# Altium project AD Sensor Module.PrjPcb
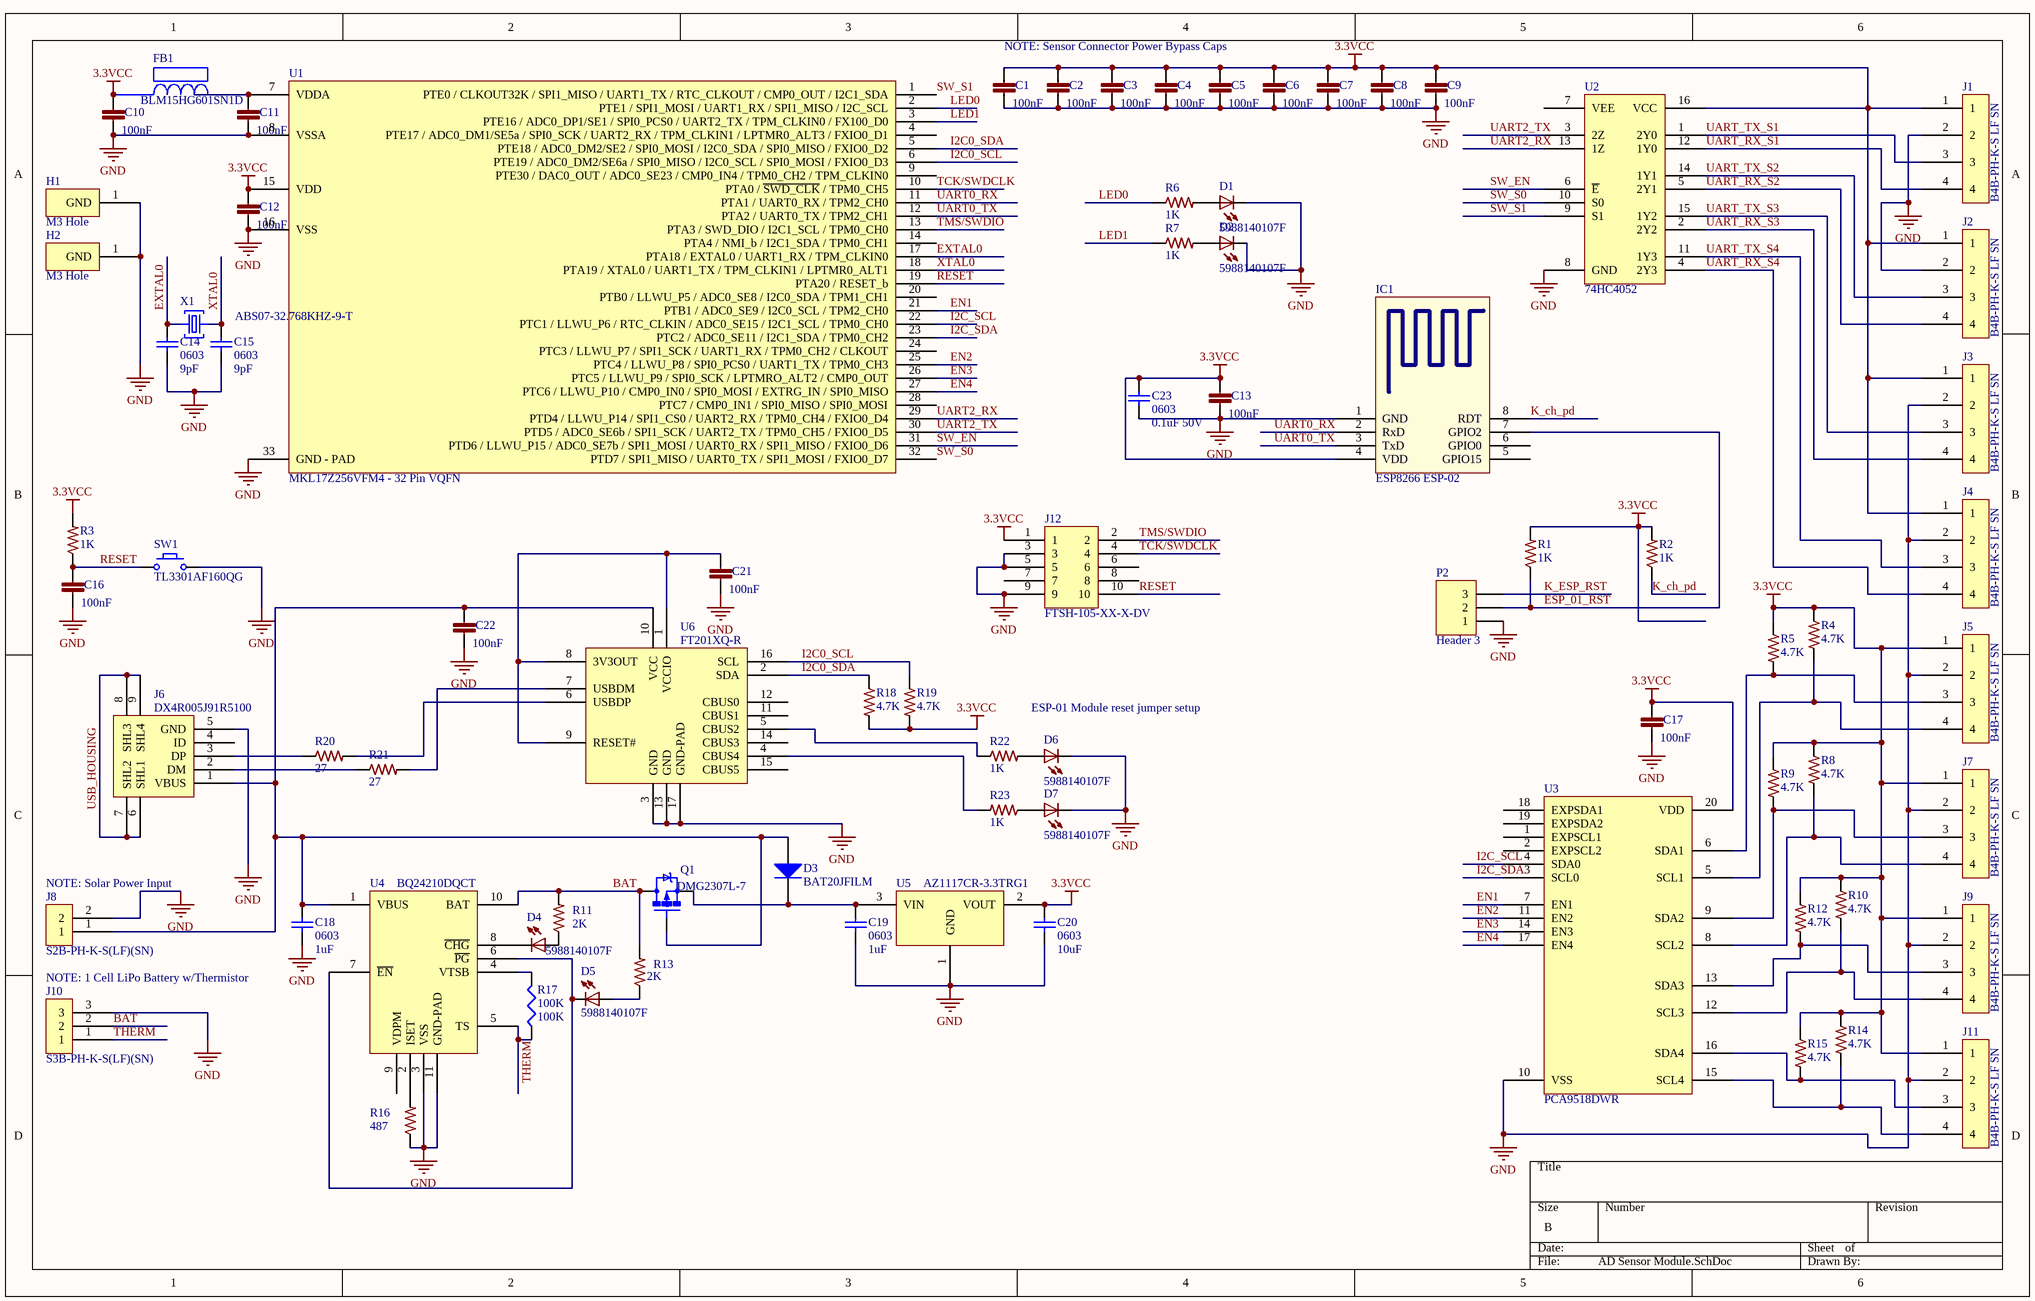
[diagram p0: AD Sensor Module.SchDoc]
1 sheet, 79 parts. Net scope: global (net labels, ports and power ports of the same name join across sheets).
Board file: AD Sensor Module.PcbDoc

## Sheet AD Sensor Module.SchDoc
size B

### Parts
C1  100nF  [C0402]
C2  100nF  [C0402]
C3  100nF  [C0402]
C4  100nF  [C0402]
C5  100nF  [C0402]
C6  100nF  [C0402]
C7  100nF  [C0402]
C8  100nF  [C0402]
C9  100nF  [C0402]
C10  100nF  [C0402]
C11  100nF  [C0402]
C12  100nF  [C0402]
C13  100nF  [C0402]
C14  0603  value 9pF  [C0603]
C15  0603  value 9pF  [C0603]
C16  100nF  [C0402]
C17  100nF  [C0402]
C18  0603  value 1uF  [C0603]
C19  0603  value 1uF  [C0603]
C20  0603  value 10uF  [C0603]
C21  100nF  [C0402]
C22  100nF  [C0402]
C23  0603  value 0.1uF 50V  [C0603]
D1  5988140107F  [LED2012120]
D2  5988140107F  [LED2012120]
D3  BAT20JFILM  [BAT20JFILM - DIOM1712X11N]
D4  5988140107F  [LED2012120]
D5  5988140107F  [LED2012120]
D6  5988140107F  [LED2012120]
D7  5988140107F  [LED2012120]
FB1  BLM15HG601SN1D  [BLM18PG121SN1D]
H1  M3 Hole  [Hole-3mm]
H2  M3 Hole  [Hole-3mm]
IC1  ESP8266 ESP-02  [ESP8266 ESP-02]
J1  B4B-PH-K-S LF SN  [B4B-PH-K-S(LF)(SN)]
J2  B4B-PH-K-S LF SN  [B4B-PH-K-S(LF)(SN)]
J3  B4B-PH-K-S LF SN  [B4B-PH-K-S(LF)(SN)]
J4  B4B-PH-K-S LF SN  [B4B-PH-K-S(LF)(SN)]
J5  B4B-PH-K-S LF SN  [B4B-PH-K-S(LF)(SN)]
J6  DX4R005J91R5100  [Micro USB Circular Holes Only]
J7  B4B-PH-K-S LF SN  [B4B-PH-K-S(LF)(SN)]
J8  S2B-PH-K-S(LF)(SN)  [S2B-PH-K-S(LF)(SN)]
J9  B4B-PH-K-S LF SN  [B4B-PH-K-S(LF)(SN)]
J10  S3B-PH-K-S(LF)(SN)  [S3B-PH-K-S(LF)(SN)]
J11  B4B-PH-K-S LF SN  [B4B-PH-K-S(LF)(SN)]
J12  FTSH-105-XX-X-DV  [FTSH-105-XX-X-DV]
P2  Header 3  [HDR1X3]
Q1  DMG2307L-7  [DMG2307L-7 - SOT92P240X102-3N]
R1  1K  [R0603]
R2  1K  [R0603]
R3  1K  [R0603]
R4  4.7K  [R0603]
R5  4.7K  [R0603]
R6  1K  [R0603]
R7  1K  [R0603]
R8  4.7K  [R0603]
R9  4.7K  [R0603]
R10  4.7K  [R0603]
R11  value 2K  [R0805]  (hidden comment: ERJ-6ENF2001V)
R12  4.7K  [R0603]
R13  value 2K  [R0805]  (hidden comment: ERJ-6ENF2001V)
R14  4.7K  [R0603]
R15  4.7K  [R0603]
R16  value 487  [R0402]  (hidden comment: RC1005F4870CS)
R17  100K  [R0402]
R18  4.7K  [R0603]
R19  4.7K  [R0603]
R20  value 27  [R0402]  (hidden comment: RR0510R-270-D)
R21  value 27  [R0402]  (hidden comment: RR0510R-270-D)
R22  1K  [R0603]
R23  1K  [R0603]
SW1  TL3301AF160QG  [TL3301AF160QG]
U1  MKL17Z256VFM4 - 32 Pin VQFN  [MKL17Z256VFM4 - QFN50P500X500X65_HS-33N]
U2  74HC4052  [74HC4052]
U3  PCA9518DWR  [PCA9518DWR]
U4  BQ24210DQCT  [bq24210 - QFN50P300X200X80-10N]
U5  AZ1117CR-3.3TRG1  [AZ1117CR-3.3TRG1 - SOT89-150P410X160-3N]
U6  FT201XQ-R  [FT201XQ-R - QFN65P400X400X80_HS-17N]
X1  ABS07-32.768KHZ-9-T  [ABS07-32.768KHZ-9-T]

### Nets
3.3VCC: C1.1 C2.1 C3.1 C4.1 C5.1 C6.1 C7.1 C8.1 C9.1 C10.1 C12.1 C13.1 C17.1 C20.2 C23.2 FB1.1 IC1.4(VDD) J1.1 J2.1 J3.1 J4.1 J5.1 J7.1 J9.1 J11.1 J12.1 R1.2 R2.2 R3.2 R4.1 R5.1 R8.1 R9.1 R10.1 R12.1 R14.1 R15.1 R18.2 R19.2 U1.15(VDD) U2.16(VCC) U3.20(VDD) U5.2(VOUT)
GND: C1.2 C2.2 C3.2 C4.2 C5.2 C6.2 C7.2 C8.2 C9.2 C10.2 C11.2 C12.2 C13.2 C14.1 C15.1 C16.2 C17.2 C18.1 C19.1 C20.1 C21.2 C22.2 C23.1 D1.C D2.C D6.C D7.C H1.1(GND) H2.1(GND) IC1.1(GND) J1.2 J2.2 J3.2 J4.2 J5.2 J6.5(GND) J7.2 J8.2 J9.2 J10.3 J11.2 J12.3 J12.5 J12.9 P2.1 R16.1 SW1.2 U1.8(VSSA) U1.16(VSS) U1.33(GND_-_PAD) U2.8(GND) U3.10(VSS) U4.3(VSS) U4.11(GND-PAD) U5.1(GND) U6.3(GND) U6.13(GND) U6.17(GND-PAD)
BAT: J10.2 Q1.3(D) R11.2 R13.2 U4.10(BAT)
EN1: U1.21(PTB1_/_ADC0_SE9_/_I2C0_SCL_/_TPM2_CH0) U3.7(EN1)
EN2: U1.25(PTC4_/_LLWU_P8_/_SPI0_PCS0_/_UART1_TX_/_TPM0_CH3) U3.11(EN2)
EN3: U1.26(PTC5_/_LLWU_P9_/_SPI0_SCK_/_LPTMRO_ALT2_/_CMP0_OUT) U3.14(EN3)
EN4: U1.27(PTC6_/_LLWU_P10_/_CMP0_IN0_/_SPI0_MOSI_/_EXTRG_IN_/_SPI0_MISO) U3.17(EN4)
ESP_01_RST: IC1.7(GPIO2) P2.2 R1.1
EXTAL0: C14.2 U1.17(PTA18_/_EXTAL0_/_UART1_RX_/_TPM_CLKIN0) X1.1(C1)
I2C0_SCL: R19.1 U1.6(PTE19_/_ADC0_DM2/SE6a_/_SPI0_MISO_/_I2C0_SCL_/_SPI0_MOSI_/_FXIO0_D3) U6.16(SCL)
I2C0_SDA: R18.1 U1.5(PTE18_/_ADC0_DM2/SE2_/_SPI0_MOSI_/_I2C0_SDA_/_SPI0_MISO_/_FXIO0_D2) U6.2(SDA)
I2C_SCL: U1.22(PTC1_/_LLWU_P6_/_RTC_CLKIN_/_ADC0_SE15_/_I2C1_SCL_/_TPM0_CH0) U3.4(SDA0)
I2C_SDA: U1.23(PTC2_/_ADC0_SE11_/_I2C1_SDA_/_TPM0_CH2) U3.3(SCL0)
K_ch_pd: IC1.8(RDT) R2.1
K_ESP_RST: P2.3
LED0: R6.1 U1.2(PTE1_/_SPI1_MOSI_/_UART1_RX_/_SPI1_MISO_/_I2C_SCL)
LED1: R7.1 U1.3(PTE16_/_ADC0_DP1/SE1_/_SPI0_PCS0_/_UART2_TX_/_TPM_CLKIN0_/_FX100_D0)
RESET: C16.1 J12.10 R3.1 SW1.1 U1.19(PTA20_/_RESET_b)
SW_EN: U1.31(PTD6_/_LLWU_P15_/_ADC0_SE7b_/_SPI1_MOSI_/_UART0_RX_/_SPI1_MISO_/_FXIO0_D6) U2.6(~{E})
SW_S0: U1.32(PTD7_/_SPI1_MISO_/_UART0_TX_/_SPI1_MOSI_/_FXIO0_D7) U2.10(S0)
SW_S1: U1.1(PTE0_/_CLKOUT32K_/_SPI1_MISO_/_UART1_TX_/_RTC_CLKOUT_/_CMP0_OUT_/_I2C1_SDA) U2.9(S1)
TCK/SWDCLK: J12.4 U1.10(PTA0_/_~{SWD_CLK}_/_TPM0_CH5)
THERM: J10.1 R17.1 U4.5(TS)
TMS/SWDIO: J12.2 U1.13(PTA3_/_SWD_DIO_/_I2C1_SCL_/_TPM0_CH0)
UART0_RX: IC1.2(RxD) U1.11(PTA1_/_UART0_RX_/_TPM2_CH0)
UART0_TX: IC1.3(TxD) U1.12(PTA2_/_UART0_TX_/_TPM2_CH1)
UART2_RX: U1.29(PTD4_/_LLWU_P14_/_SPI1_CS0_/_UART2_RX_/_TPM0_CH4_/_FXIO0_D4) U2.13(1Z)
UART2_TX: U1.30(PTD5_/_ADC0_SE6b_/_SPI1_SCK_/_UART2_TX_/_TPM0_CH5_/_FXIO0_D5) U2.3(2Z)
UART_RX_S1: J1.4 U2.12(1Y0)
UART_RX_S2: J2.4 U2.5(2Y1)
UART_RX_S3: J3.4 U2.2(2Y2)
UART_RX_S4: J4.4 U2.4(2Y3)
UART_TX_S1: J1.3 U2.1(2Y0)
UART_TX_S2: J2.3 U2.14(1Y1)
UART_TX_S3: J3.3 U2.15(1Y2)
UART_TX_S4: J4.3 U2.11(1Y3)
USB_HOUSING: J6.6(SHL1) J6.7(SHL2) J6.8(SHL3) J6.9(SHL4)
XTAL0: C15.2 U1.18(PTA19_/_XTAL0_/_UART1_TX_/_TPM_CLKIN1_/_LPTMR0_ALT1) X1.2(C2)
NetC11_1: C11.1 FB1.2 U1.7(VDDA)
NetC18_2: C18.2 C22.1 D3.2(K) J6.1(VBUS) J8.1 Q1.1(G) U4.1(VBUS) U6.10(VCC)
NetC19_2: C19.2 D3.1(A) Q1.2(S) U5.3(VIN)
NetC21_1: C21.1 U6.1(VCCIO) U6.8(3V3OUT) U6.9(RESET#)
NetD1_A: D1.A R6.2
NetD2_A: D2.A R7.2
NetD4_A: D4.A R11.1
NetD4_C: D4.C U4.8(~{CHG})
NetD5_A: D5.A R13.1
NetD5_C: D5.C U4.6(~{PG}) U4.7(~{EN})
NetD6_A: D6.A R22.2
NetD7_A: D7.A R23.1
NetJ5_3: J5.3 R5.2 U3.6(SDA1)
NetJ5_4: J5.4 R4.2 U3.5(SCL1)
NetJ6_2: J6.2(DM) R21.1
NetJ6_3: J6.3(DP) R20.1
NetJ7_3: J7.3 R9.2 U3.9(SDA2)
NetJ7_4: J7.4 R8.2 U3.8(SCL2)
NetJ9_3: J9.3 R12.2 U3.13(SDA3)
NetJ9_4: J9.4 R10.2 U3.12(SCL3)
NetJ11_3: J11.3 R15.2 U3.16(SDA4)
NetJ11_4: J11.4 R14.2 U3.15(SCL4)
NetR16_2: R16.2 U4.2(ISET)
NetR17_2: R17.2 U4.4(VTSB)
NetR20_2: R20.2 U6.6(USBDP)
NetR21_2: R21.2 U6.7(USBDM)
NetR22_1: R22.1 U6.5(CBUS2)
NetR23_2: R23.2 U6.4(CBUS4)

Not connected (* = marked no-connect by the designer): IC1 5(GPIO15) 6(GPIO0); J6 4(ID); J12 6 7 8; U1 4(PTE17_/_ADC0_DM1/SE5a_/_SPI0_SCK_/_UART2_RX_/_TPM_CLKIN1_/_LPTMR0_ALT3_/_FXIO0_D1) 9(PTE30_/_DAC0_OUT_/_ADC0_SE23_/_CMP0_IN4_/_TPM0_CH2_/_TPM_CLKIN0) 14(PTA4_/_NMI_b_/_I2C1_SDA_/_TPM0_CH1) 20(PTB0_/_LLWU_P5_/_ADC0_SE8_/_I2C0_SDA_/_TPM1_CH1) 24(PTC3_/_LLWU_P7_/_SPI1_SCK_/_UART1_RX_/_TPM0_CH2_/_CLKOUT) 28(PTC7_/_CMP0_IN1_/_SPI0_MISO_/_SPI0_MOSI); U2 7(VEE); U3 1(EXPSCL1) 2(EXPSCL2) 18(EXPSDA1) 19(EXPSDA2); U4 9(VDPM); U6 11(CBUS1) 12(CBUS0) 14(CBUS3) 15(CBUS5)

### Notes on the sheet
- NOTE: Sensor Connector Power Bypass Caps
- ESP-01 Module reset jumper setup
- (near J8) NOTE: Solar Power Input
- NOTE: 1 Cell LiPo Battery w/Thermistor

### Library data of the parts
C1-C13 C16 C17 C21 C22 = GRM155R71C104KA88D: CAP CER 0402 100nF 16V 10% X7R; LastRevisionNote: ImportComponents; Published: 23-Apr-2014; Publisher: UltiMachine; LastRevisionDate: 23-Apr-2014; ManufacturerPartNumber: GRM155R71C104KA88D; VALUE: 100nF
C14 C15 = CL10C090CB8NNNC: CAP CER 9PF 50V NP0 0603; MFR: Samsung Electro-Mechanics America, Inc.; Pin Count #: 2; Tolerance: 10%; Type: Capacitor / Passive; Lead-Free ?: Yes; Voltage: 6.3V; Designer: Adam Vadala-Roth; MFR #: CL10C090CB8NNNC; Status: Available; Mounting: SMT; Datasheet: http://www.samsungsem.com/kr/support/product-search/mlcc/__icsFiles/afieldfile/2015/06/03/CL10C090CB8NNNC.pdf; Height: 0.9mm; Cost: $0.00805 @ 4000; Date Created: 11 Mar 2016; Last Modified: 11 Mar 2016
C18 C19 = CL05A105KA5NQNC: CAP CER 1UF 25V X5R 0402; MFR: Samsung; Tolerance: 1%; Voltage: 50VDC; Published: 22 - Feb - 2016; LatestRevisionDate: April 2015; Component Type: Chip Capacitor; MFR Part #: CL05A105KA5NQNC; Part Description: CAP CER 1UF 25V X5R 0402; Mounting Type: SMT 0603; Datasheet: http://www.samsungsem.com/kr/front/downloadcms.do?path=/kr/support/product-search/mlcc/__icsFiles/afieldfile/2014/11/05&fileName=S_CL10B223JB8NNNC.pdf; Height: 0.9mm; Digikey #: 1276-1445-1-ND; PackageReference: 0603
C20 = CL10A106KQ8NNNC: CAP CER 10UF 6.3V X5R 0603; MFR: Samsung Electro-Mechanics America, Inc.; Pin Count #: 2; Tolerance: 10%; Type: Capacitor / Passive; Lead-Free ?: Yes; Designer: Adam Vadala-Roth; MFR #: CL10A106KQ8NNNC; Status: Available; Mounting: SMT; Datasheet: http://www.samsungsem.com/kr/support/product-search/mlcc/__icsFiles/afieldfile/2015/08/14/S_CL10A106KQ8NNNC.pdf; Height: 0.9mm; Cost: $0.05145; Voltage: 6.3V; Date Created: 25 Feb 2016; Last Modified: 25 Feb 2016
C23 = CL10B104KB8SFNC: CAP CER 0.1UF 50V 10% X7R 0603; MFR: Samsung; Voltage: 50VDC; Published: 10 - Dec - 2014; LatestRevisionDate: April 2015; Component Type: Chip Capacitor; MFR Part #: CL10B104KB8SFNC; Part Description: CAP CER 0.1UF 50V 10% X7R 0603; Mounting Type: SMT 0603; Datasheet: http://www.samsungsem.com/kr/front/downloadcms.do?path=/kr/support/product-search/mlcc/__icsFiles/afieldfile/2014/11/05&fileName=S_CL10B104KB8SFNC.pdf; Height: 0.9mm; Tolerance: 10%; Digikey #: 1276-1936-1-ND; PackageReference: 0603
D1 D2 D4-D7 = 5988140107F: LED 0805 Yellow; LastRevisionNote: ImportComponents; Published: 23-Apr-2014; Publisher: UltiMachine; LastRevisionDate: 23-Apr-2014; VALUE: 5988140107F
D3 = BAT20JFILM: DIODE SCHOTTKY 23V 1A SOD323; MFR: ST Microelectronics; Designer: Adam J Valala-Roth; Published: 25 Feb 2016; LatestRevisionDate: 25 Feb 2016; Mounting: SMT; Publisher: Altium Limited; Package: DO-214-AB/SMC; 2 C-Bend Leads; Body 7.9 x 5.9 mm, inc. leads (LxW); MFR#: BAT20JFILM; Digikey #: 497-3381-1-ND; Height: *; Cost: $0.44
H1 H2 = Hole: 3mm Hole
J1-J5 J7 J9 J11 = B4B-PH-K-S LF SN: CONN HEADER PH TOP 4POS 2MM; MFR: JST; Pin Count #: 2; Lead-Free ?: Yes; Designer: Adam Vadala-Roth; MFR #: B4B-PH-K-S(LF)(SN); Status: Available; Mounting: Throughhole; Datasheet: http://www.jst-mfg.com/product/pdf/eng/ePH.pdf; Height: *; Tolerance: *; Cost: $0.24; Type: Connector 2mm Pitch Shrouded Pin; Voltage: *; Date Created: 26 Feb 2016; Last Modified: 26 Feb 2016
J6 = Micro USB: Micro USB Jack B
J8 = S2B-PH-K-S(LF)(SN): CONN HEADER PH SIDE 2POS 2MM; MFR: JST; Pin Count #: 2; Lead-Free ?: Yes; Designer: Adam Vadala-Roth; MFR #: S2B-PH-K-S(LF)(SN); Status: Available; Mounting: Throughhole; Datasheet: http://www.jst-mfg.com/product/pdf/eng/ePH.pdf; Height: *; Tolerance: *; Cost: $0.17; Type: Connector 2mm Pitch Shrouded Pin; Voltage: *; Date Created: 26 Feb 2016; Last Modified: 26 Feb 2016
J10 = S3B-PH-K-S(LF)(SN): CONN HEADER PH SIDE 2POS 2MM; MFR: JST; Pin Count #: 3; Lead-Free ?: Yes; Designer: Adam Vadala-Roth; MFR #: S3B-PH-K-S(LF)(SN); Status: Available; Mounting: Throughhole; Datasheet: http://www.jst-mfg.com/product/pdf/eng/ePH.pdf; Height: *; Tolerance: *; Cost: $0.17; Type: Connector 2mm Pitch Shrouded Pin; Voltage: *; Date Created: 11 Mar 2016; Last Modified: 11 Mar 2016
J12 = FTSH-105-XX-X-DV: FTSH-105-XX-X-DV ARM COrtex JTAG; MFR #: FTSH-105-XX-X-DV; MFR: *; Status: *; Pin Count #: *; Mounting: *; Datasheet: *; Height: *; Tolerance: *; Cost: *; Type: *; Lead-Free ?: *; Voltage: *; Date Created: *; Last Modified: *; Designer: *
P2 = Header 3: Header, 3-Pin; LatestRevisionDate: 17-Jul-2002; LatestRevisionNote: Re-released for DXP Platform.; Publisher: Altium Limited
Q1 = DMG2307L-7: MOSFET P-CH 30V 2.5A SOT-23; MFR: Diodes Incorporated; Published: 25 Feb 2016; LatestRevisionDate: 25 Feb 2016; LatestRevisionNote: IPC-7351 Footprint Added.; PackageReference: SOT23 SMT package; Publisher: Adam Vadala-Roth; PackageDescription: SOT23; MFR#: DMG2307L-7
R1-R3 R6 R7 R22 R23 = ERJ-3EKF1001V: RES 0603 1K 100mW 1%; LastRevisionNote: ImportComponents; Published: 23-Apr-2014; Publisher: UltiMachine; LastRevisionDate: 23-Apr-2014; ManufacturerPartNumber: ERJ-3EKF1001V; VALUE: 1K
R4 R5 R8-R10 R12 R14 R15 R18 R19 = ERJ3EKF4701V: RES 0603 4.7K 100mW 1%; LastRevisionNote: ImportComponents; Published: 23-Apr-2014; Publisher: UltiMachine; LastRevisionDate: 23-Apr-2014; ManufacturerPartNumber: ERJ3EKF4701V; VALUE: 4.7K
R11 R13 = ERJ-6ENF2001V: RES SMD 2K OHM 1% 1/8W 0805; MFR: Panasonic Electronic Components; Pin Count #: 2; Lead-Free ?: Yes; Designer: Adam Vadala-Roth; MFR #: ERJ-6ENF2001V; Status: Active; Mounting: SMT/SMD; Datasheet: http://industrial.panasonic.com/www-cgi/jvcr13pz.cgi?E+PZ+3+AOA0002+ERJ6ENF2001V+7+WW; Height: 0.7mm; Tolerance: 1%; Cost: *; Type: Chip Resistor/Passive; Voltage: *; Date Created: 10 Mar 2016; Last Modified: 10 Mar 2016
R16 = RC1005F4870CS: RES SMD 487 OHM 1% 1/16W 0402; MFR: Samsung Electro-Mechanics America, Inc.; Pin Count #: 2; Lead-Free ?: Yes; Designer: Adam Vadala-Roth; MFR #: RC1005F4870CS; Status: Active; Mounting: SMT/SMD; Datasheet: http://industrial.panasonic.com/www-cgi/jvcr13pz.cgi?E+PZ+3+AOA0002+ERJ6ENF2001V+7+WW; Height: 0.7mm; Tolerance: 1%; Cost: 0.00203 @ 10K; Type: 0402 Passive; Voltage: *; Date Created: 11 Mar 2016; Last Modified: 11 Mar 2016
R17 = Standin 0402: MFR #: Standin O603; PackageReference: 0603; MFR: N/A; Digikey #: P100KHCT-ND; PDF: http://industrial.panasonic.com/www-cgi/jvcr13pz.cgi?E+PZ+3+AOA0002+ERJ3EKF1003V+7+WW; Value: 100K
R20 R21 = RR0510R-270-D: RES SMD 27 OHM 0.5% 1/16W 0402; MFR: Susumu; Pin Count #: 2; Lead-Free ?: Yes; Designer: Adam Vadala-Roth; MFR #: RR0510R-270-D; Status: Active; Mounting: SMT/SMD; Datasheet: http://www.susumu-usa.com/pdf/RR_Data_Sheet.pdf; Height: 0.4mm; Tolerance: 0.5%; Cost: 0.00815 @ 10K; Type: 0402 Passive; Voltage: *; Date Created: 14 Mar 2016; Last Modified: 14 Mar 2016
U1 = MKL17Z256VFM4 - 32 Pin VQFN: ARM Cortex M0+ Microcontroller for Low Power Applications, MKL1x Series; MFR: NXP - FreeScale; Pin Count #: 32; Lead-Free ?: Yes; Voltage: 1.7-3.3VDC; Designer: Adam Vadala-Roth; MFR #: MKL17Z256VFM4; Status: Active; Mounting: SMT/SMD; Datasheet: *; Height: *; Tolerance: *; Cost: *; Type: IC; Date Created: 9 Mar 2016; Last Modified: 9 Mar 2016
U2 = 74HC4052: Dual 4-channel analog multiplexer/demultiplexer; MFR: NXP; Mouting Type: SMT; MFR#: 74HC4052; Type: 74 logic, analog mulitplexer/demultiplexer; Datasheet: http://www.nxp.com/documents/data_sheet/74HC_HCT4052.pdf
U3 = PCA9518DWR: IC EXPANDABLE 5CH I2C HUB 20SOIC; MFR: Ti; MFR#: PCA9518DWR; Type: I2C Hub 20 Pin SOIC; Date Added: April 2015; Digikey#: 296-22766-1-ND
U4 = BQ24210DQCT: IC BATT CHARGER LI-ION 10WSON (VBUS and Solar Voltaic Cell); MFR: Texas Instruments; Pin Count #: 8; Lead-Free ?: Yes; Designer: Adam J Vadala-Roth; MFR #: BQ24210DQCT; Status: Active; Mounting: SMT/SMD; Datasheet: http://www.ti.com/lit/ds/symlink/bq24210.pdf; Height: 0.8mm; Tolerance: *; Cost: *; Type: Solar Battery charger; Voltage: *; Date Created: 6 Mar 2016; Last Modified: 6 Mar 2016
U5 = AZ1117CR-3.3TRG1: IC REG LDO 3.3V 0.8A SOT89; MFR: Diodes Inc; Pin Count #: 4; Lead-Free ?: Yes; Voltage: 3V3; Designer: Adam Vadala-Roth; MFR #: AZ1117CR-3.3TRG1; Status: Active; Mounting: SMT/SMD; Datasheet: http://www.diodes.com/_files/datasheets/AZ1117C.pdf; Height: *; Tolerance: *; Cost: *; Type: LDO Voltage Regulator; Date Created: 8 Mar 2016; Last Modified: 8 Mar 2016
U6 = FT201XQ-R: IC USB FS I2C 16QFN; MFR: FTDI; Pin Count #: 16; Lead-Free ?: yes; Voltage: 3V3/5V; Designer: Adam Vadala-Roth; MFR #: FT201XQ-R; Status: Active; Mounting: SMT/SMD; Datasheet: http://www.ftdichip.com/Support/Documents/DataSheets/ICs/DS_FT201X.pdf; Height: 0.8mm; Tolerance: *; Cost: *; Type: USB to I2C converter; Date Created: 14 Mar 2016; Last Modified: 14 Mar 2016
X1 = ABS07-32.768KHZ-9-T: 32.768kHz ±20ppm Crystal 9pF 70 kOhm -40°C ~ 85°C Surface Mount 2-SMD; MFR: Abracon LLC; Pin Count #: 2; Lead-Free ?: Yes; Designer: Adam Vadala-Roth; MFR #: ABS07-32.768KHZ-9-T; Status: Active; Mounting: SMT/SMD; Datasheet: http://www.abracon.com/Resonators/ABS07.pdf; Height: 2.5mm; Tolerance: ±20ppm; Cost: 0.18000 @ 3K; Type: Crystal Oscillator; Voltage: *; Date Created: 11 Mar 2016; Last Modified: 11 Mar 2016; Value: *; Loading Capacitance: 9pF
SW1 = TL3301AF160QG: MFR: *; MFR#: TL3301AF160QG; Type: SMD Momentary Tactile Switch; Height: *